# EasyEDA Pro project ProDoc_Schematic1_2025-02-22.epro

# Schematic Schematic1
Board Name: Board1; Create Date: 2025-02-19; Page Name: P1; Project Name: irblasterthingidk; Schematic Name: Schematic1; Update Date: 2025-02-22; Company: EasyEDA.com; Page Size: A4; Version: V1.0
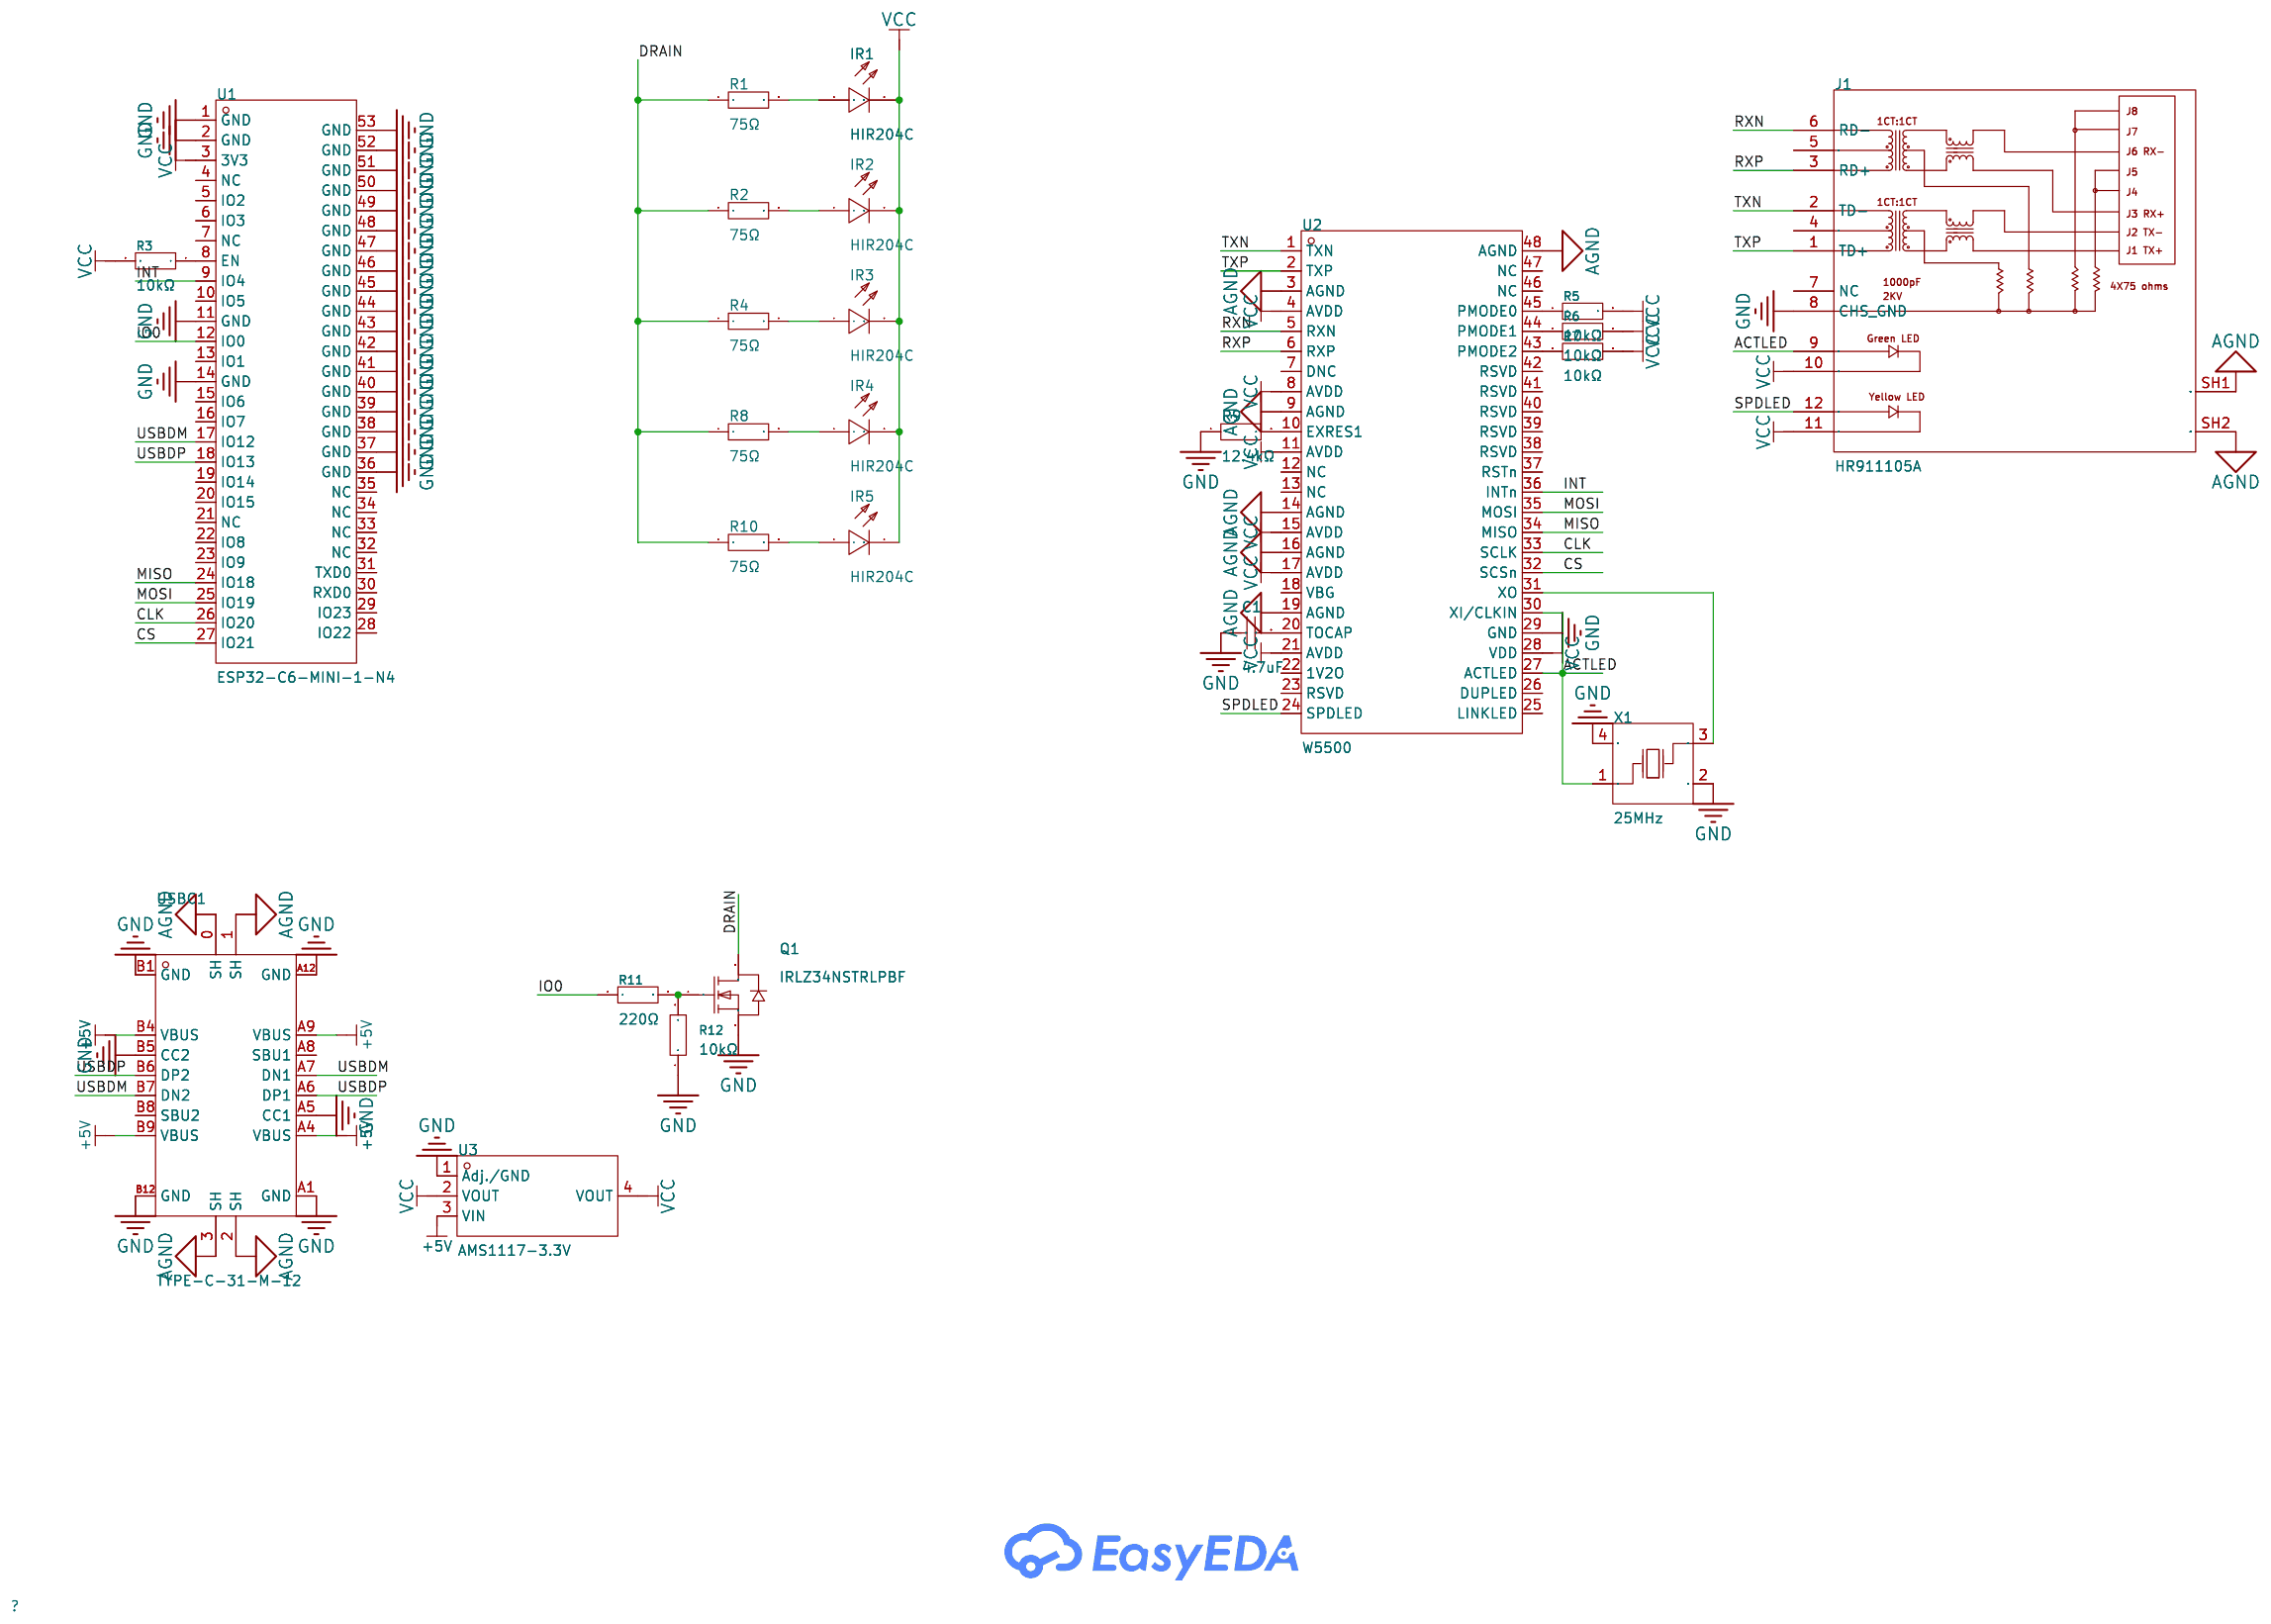
[diagram p0: schematic sheet]

## Parts
C1  4.7uF  [C0805]
IR1  HIR204C  [LED-TH_BD4.2-P2.54-FD]
IR2  HIR204C  [LED-TH_BD4.2-P2.54-FD]
IR3  HIR204C  [LED-TH_BD4.2-P2.54-FD]
IR4  HIR204C  [LED-TH_BD4.2-P2.54-FD]
IR5  HIR204C  [LED-TH_BD4.2-P2.54-FD]
J1  HR911105A  [RJ45-TH_HR911105A]
Q1  IRLZ34NSTRLPBF  [DPAK_L10.2-W9.1-P5.08-LS15.2-BL-CW]
R1  75Ω  [R0603]
R2  75Ω  [R0603]
R3  10kΩ  [R0805]
R4  75Ω  [R0603]
R5  10kΩ  [R0805]
R6  10kΩ  [R0805]
R7  10kΩ  [R0805]
R8  75Ω  [R0603]
R9  12.4kΩ  [R0603]
R10  75Ω  [R0603]
R11  220Ω  [R0603]
R12  10kΩ  [R0805]
U1  ESP32-C6-MINI-1-N4  [WIFIM-SMD_61P-L16.6-W13.2-P0.80-ESP32-C6-MINI-1-N4]
U2  W5500  [LQFP-48_L7.0-W7.0-P0.50-LS9.0-BL]
U3  AMS1117-3.3V  [SOT-223-3_L6.5-W3.4-P2.30-LS7.0-BR]
USBC1  TYPE-C-31-M-12  [USB-C_SMD-TYPE-C-31-M-12]
X1  25MHz  [CRYSTAL-SMD_4P-L3.2-W2.5-BL]

## Library data of the parts
C1 = CL21A475KAQNNNE: Capacitance: Tolerance:±10% Tolerance:±10% Voltage Rated: Temperature Coefficient:; LCSC Part Name: 4.7uF ±10% 25V; Supplier Part: C1779; Manufacturer: SAMSUNG(三星); Supplier Footprint: 0805; JLCPCB Part Class: Basic Part; Datasheet: https://atta.szlcsc.com/upload/public/pdf/source/20160218/1457707763339.pdf; Supplier: LCSC; Tolerance: ±10%
IR1-IR5 = HIR204C: Vf - Forward Voltage:1.45V Vf - Forward Voltage:1.45V Wavelength:850nm Wavelength:850nm Radiant Intensity: View Angle:25° Operating Temperature:-40℃~+85℃ Operating Temperature:-40℃~+85℃; LCSC Part Name: HIR204C 3mm 850nm R档; Supplier Part: C5118; Manufacturer: EVERLIGHT(亿光); Supplier Footprint: 插件,D=3mm; JLCPCB Part Class: Extended Part; Datasheet: https://atta.szlcsc.com/upload/public/pdf/source/20170228/1488267637610.pdf; Supplier: LCSC; Vf - Forward Voltage: 1.45V; Wavelength: 850nm; View Angle: 25°; Operating Temperature: -40℃~+85℃
J1 = HR911105A_C12074: Connector Type:RJ45Receptacle Mounting Style:- Number of Ports:1 LED:WithLED Shielding:- Ratings:- PoE:Without PoE Supplementary Features:With filtering Contact Material:- Contact Plating:- Operating Temperature Range:- Operating Temperature Range:-; LCSC Part Name: 带LED; Supplier Part: C12074; Manufacturer: HANRUN(汉仁); Supplier Footprint: 插件; JLCPCB Part Class: Extended Part; Datasheet: https://atta.szlcsc.com/upload/public/pdf/source/20170918/C12074_1505726819496976146.pdf; Supplier: LCSC; Connector Type: RJ45Receptacle; Number of Ports: 1; LED: WithLED; PoE: Without PoE; Supplementary Features: With filtering
Q1 = IRLZ34NSTRLPBF: Type:1 N-Channel Drain Source Voltage (Vdss): Continuous Drain Current (Id): Drain Source On Resistance (RDS(on)@Vgs,Id):0.035Ω@10V,16A Power Dissipation (Pd): Gate Threshold Voltage (Vgs(th)@Id):1V@250uA Total Gate Charge (Qg@Vgs):25nC Input Capacitance; LCSC Part Name: 1个N沟道 耐压:55V 电流:30A; Supplier Part: C538198; Manufacturer: Infineon(英飞凌); Supplier Footprint: D2PAk; JLCPCB Part Class: Extended Part; Datasheet: https://atta.szlcsc.com/upload/public/pdf/source/20240415/AB964699F0EAA32D992C9FC2B4E5BADE.pdf; Supplier: LCSC; Type: 1 N-Channel; Drain Source On Resistance (RDS(on)@Vgs,Id): 0.035Ω@10V,16A; Gate Threshold Voltage (Vgs(th)@Id): 1V@250uA; Total Gate Charge (Qg@Vgs): 25nC; Input Capacitance (Ciss@Vds): 880pF; Reverse Transfer Capacitance (Crss@Vds): 94pF; Operating Temperature: -55℃~+175℃
R1 R2 R4 R8 R10 = 0603WAF750JT5E: Type:Thick Film Resistors Resistance:75Ω Tolerance:±1% Tolerance:±1% Power(Watts): Overload Voltage (Max): Temperature Coefficient:±200ppm/℃ Temperature Coefficient:±200ppm/℃ Operating Temperature Range:-55℃~+155℃ Operating Temperature Range:-55℃~+155℃; LCSC Part Name: 75Ω ±1% 100mW 厚膜电阻; Supplier Part: C4275; Manufacturer: UNI-ROYAL(厚声); Supplier Footprint: 0603; JLCPCB Part Class: Basic Part; Datasheet: https://atta.szlcsc.com/upload/public/pdf/source/20200306/C422600_1E6D84923E4A46A82E41ADD87F860B5C.pdf; Supplier: LCSC; Type: Thick Film Resistors; Tolerance: ±1%; Temperature Coefficient: ±200ppm/℃; Operating Temperature Range: -55℃~+155℃
R3 R5-R7 R12 = 0805W8F1002T5E: Type:Thick Film Resistors Resistance:10kΩ Tolerance:±1% Tolerance:±1% Power(Watts): Overload Voltage (Max): Temperature Coefficient:±100ppm/℃ Temperature Coefficient:±100ppm/℃ Operating Temperature Range:-55℃~+155℃ Operating Temperature Range:-55℃~+155℃; LCSC Part Name: 10kΩ ±1% 125mW 厚膜电阻; Supplier Part: C17414; Manufacturer: UNI-ROYAL(厚声); Supplier Footprint: 0805; JLCPCB Part Class: Basic Part; Datasheet: https://atta.szlcsc.com/upload/public/pdf/source/20200306/C422600_1E6D84923E4A46A82E41ADD87F860B5C.pdf; Supplier: LCSC; Type: Thick Film Resistors; Tolerance: ±1%; Temperature Coefficient: ±100ppm/℃; Operating Temperature Range: -55℃~+155℃
R9 = 0603WAF1242T5E: Type:Thick Film Resistors Resistance:12.4kΩ Tolerance:±1% Tolerance:±1% Power(Watts): Overload Voltage (Max): Temperature Coefficient:±100ppm/℃ Temperature Coefficient:±100ppm/℃ Operating Temperature Range:-55℃~+155℃ Operating Temperature Range:-55℃~+155℃; LCSC Part Name: 12.4kΩ ±1% 100mW 厚膜电阻; Supplier Part: C22865; Manufacturer: UNI-ROYAL(厚声); Supplier Footprint: 0603; JLCPCB Part Class: Extended Part; Datasheet: https://atta.szlcsc.com/upload/public/pdf/source/20200306/C422600_1E6D84923E4A46A82E41ADD87F860B5C.pdf; Supplier: LCSC; Type: Thick Film Resistors; Tolerance: ±1%; Temperature Coefficient: ±100ppm/℃; Operating Temperature Range: -55℃~+155℃
R11 = 0603WAF2200T5E: Type:Thick Film Resistors Resistance: Tolerance:±1% Tolerance:±1% Power(Watts): Overload Voltage (Max): Temperature Coefficient:±100ppm/℃ Temperature Coefficient:±100ppm/℃ Operating Temperature Range:-55℃~+155℃ Operating Temperature Range:-55℃~+155℃; LCSC Part Name: 220Ω ±1% 100mW 厚膜电阻; Supplier Part: C22962; Manufacturer: UNI-ROYAL(厚声); Supplier Footprint: 0603; JLCPCB Part Class: Basic Part; Datasheet: https://atta.szlcsc.com/upload/public/pdf/source/20200306/C422600_1E6D84923E4A46A82E41ADD87F860B5C.pdf; Supplier: LCSC; Type: Thick Film Resistors; Tolerance: ±1%; Temperature Coefficient: ±100ppm/℃; Operating Temperature Range: -55℃~+155℃
U1 = ESP32-C6-MINI-1-N4: Supplier Part: C5736265; Manufacturer: ESPRESSIF(乐鑫); Supplier Footprint: SMD-53P; JLCPCB Part Class: Extended Part; Datasheet: https://atta.szlcsc.com/upload/public/pdf/source/20240130/4529D418EFEC832950EB8101798FAED6.pdf; Supplier: LCSC
U2 = W5500: channel:8 IO Type:SPI Supply Voltage:3.3V Supply Voltage:3.3V Supply Current:132mA Operating Temperature  range:-40℃~+85℃ Operating Temperature  range:-40℃~+85℃; LCSC Part Name: W5500硬连线TCP/IP嵌入式以太网控制器; Supplier Part: C32843; Manufacturer: WIZNET; Supplier Footprint: LQFP-48(7x7); JLCPCB Part Class: Extended Part; Datasheet: https://atta.szlcsc.com/upload/public/pdf/source/20230714/E10C32B058E0BA54FCE1C1556BE10C07.pdf; Supplier: LCSC; channel: 8; IO Type: SPI; Supply Voltage: 3.3V; Supply Current: 132mA; Operating Temperature  range: -40℃~+85℃
U3 = AMS1117-3.3V_C17702043: Output Type:Fixed Maximum Input Voltage:12V Output Voltage:3.3V Output Voltage:3.3V Output Current:1A; LCSC Part Name: 输入12V 输出3.3V 1A; Supplier Part: C17702043; Manufacturer: HXY MOSFET(华轩阳电子); Supplier Footprint: SOT-223; JLCPCB Part Class: Extended Part; Datasheet: https://atta.szlcsc.com/upload/public/pdf/source/20230912/D3384878F5C576B1BC7138E74285AA14.pdf; Supplier: LCSC; Output Type: Fixed; Maximum Input Voltage: 12V; Output Voltage: 3.3V; Output Current: 1A
USBC1 = TYPE-C-31-M-12: Connector Type:Type-C Standard:- Gender:Female Mounting Style:- Number of Contacts:16P Number of Ports:1 Current Rating - Power (Max):5A Operating Temperature Range:- Operating Temperature Range:-; LCSC Part Name: Type-C 母; Supplier Part: C165948; Manufacturer: 韩国韩荣; Supplier Footprint: SMD; JLCPCB Part Class: Extended Part; Datasheet: https://atta.szlcsc.com/upload/public/pdf/source/20220525/466408E853115E789EDB0DDC29077C05.pdf; Supplier: LCSC; Connector Type: Type-C; Gender: Female; Number of Contacts: 16P; Number of Ports: 1; Current Rating - Power (Max): 5A
X1 = X322525MOB4SI: Crystal Type:Surface Mount Crystal Frequency: Normal temperature Frequency Tolerance:±10ppm Normal temperature Frequency Tolerance:±10ppm Load Capacitor: Frequency Stability(Full temperature range):±20ppm Frequency Stability(Full temperature range):±20ppm; LCSC Part Name: 25MHz ±10ppm 12pF; Supplier Part: C9006; Manufacturer: YXC(扬兴晶振); Supplier Footprint: SMD3225-4P; JLCPCB Part Class: Basic Part; Datasheet: https://atta.szlcsc.com/upload/public/pdf/source/20240329/19D5F850207469550BEB00D7DFEDBC7A.pdf; Supplier: LCSC; Crystal Type: Surface Mount Crystal; Normal temperature Frequency Tolerance: ±10ppm; Frequency Stability(Full temperature range): ±20ppm

## Nets
+5V: U3.3(VIN) USBC1.A4(VBUS) USBC1.A9(VBUS) USBC1.B4(VBUS) USBC1.B9(VBUS)
AGND: J1.SH1 J1.SH2 U2.3(AGND) U2.9(AGND) U2.14(AGND) U2.16(AGND) U2.19(AGND) U2.48(AGND) USBC1.0(SH) USBC1.1(SH) USBC1.2(SH) USBC1.3(SH)
GND: C1.1 J1.8(CHS GND) Q1.3(S) R9.1 R12.1 U1.1(GND) U1.2(GND) U1.11(GND) U1.14(GND) U1.36(GND) U1.37(GND) U1.38(GND) U1.39(GND) U1.40(GND) U1.41(GND) U1.42(GND) U1.43(GND) U1.44(GND) U1.45(GND) U1.46(GND) U1.47(GND) U1.48(GND) U1.49(GND) U1.50(GND) U1.51(GND) U1.52(GND) U1.53(GND) U2.29(GND) U3.1(Adj./GND) USBC1.A1(GND) USBC1.A5(CC1) USBC1.A12(GND) USBC1.B1(GND) USBC1.B5(CC2) USBC1.B12(GND) X1.2(GND) X1.4(GND)
VCC: IR1.2(C) IR2.2(C) IR3.2(C) IR4.2(C) IR5.2(C) J1.10 J1.11 R3.2 R5.2 R6.2 R7.2 U1.3(3V3) U2.4(AVDD) U2.8(AVDD) U2.11(AVDD) U2.15(AVDD) U2.17(AVDD) U2.21(AVDD) U2.28(VDD) U3.2(VOUT) U3.4(VOUT)
ACTLED: J1.9 U2.27(ACTLED)
CLK: U1.26(IO20) U2.33(SCLK)
CS: U1.27(IO21) U2.32(SCSn)
DRAIN: Q1.2(D) R1.1 R2.1 R4.1 R8.1 R10.1
INT: U1.9(IO4) U2.36(INTn)
IO0: R11.1 U1.12(IO0)
MISO: U1.24(IO18) U2.34(MISO)
MOSI: U1.25(IO19) U2.35(MOSI)
RXN: J1.6(RD-) U2.5(RXN)
RXP: J1.3(RD+) U2.6(RXP)
SPDLED: J1.12 U2.24(SPDLED)
TXN: J1.2(TD-) U2.1(TXN)
TXP: J1.1(TD+) U2.2(TXP)
USBDM: U1.17(IO12) USBC1.A7(DN1) USBC1.B7(DN2)
USBDP: U1.18(IO13) USBC1.A6(DP1) USBC1.B6(DP2)
Net-(C1-2): C1.2 U2.20(TOCAP)
Net-(IR1-1): IR1.1(A) R1.2
Net-(IR2-1): IR2.1(A) R2.2
Net-(IR3-1): IR3.1(A) R4.2
Net-(IR4-1): IR4.1(A) R8.2
Net-(IR5-1): IR5.1(A) R10.2
Net-(Q1-1): Q1.1(G) R11.2 R12.2
Net-(R3-1): R3.1 U1.8(EN)
Net-(R5-1): R5.1 U2.45(PMODE0)
Net-(R6-1): R6.1 U2.44(PMODE1)
Net-(R7-1): R7.1 U2.43(PMODE2)
Net-(R9-2): R9.2 U2.10(EXRES1)
Net-(U2-30): U2.30(XI/CLKIN) X1.1(OSC1)
Net-(U2-31): U2.31(XO) X1.3(OSC2)

Not connected (* = marked no-connect by the designer): J1 4 5 7(NC); U1 4(NC) 5(IO2) 6(IO3) 7(NC) 10(IO5) 13(IO1) 15(IO6) 16(IO7) 19(IO14) 20(IO15) 21(NC) 22(IO8) 23(IO9) 28(IO22) 29(IO23) 30(RXD0) 31(TXD0) 32(NC) 33(NC) 34(NC) 35(NC); U2 7(DNC) 12(NC) 13(NC) 18(VBG) 22(1V2O) 23(RSVD) 25(LINKLED) 26(DUPLED) 37(RSTn) 38(RSVD) 39(RSVD) 40(RSVD) 41(RSVD) 42(RSVD) 46(NC) 47(NC); USBC1 A8(SBU1) B8(SBU2)
